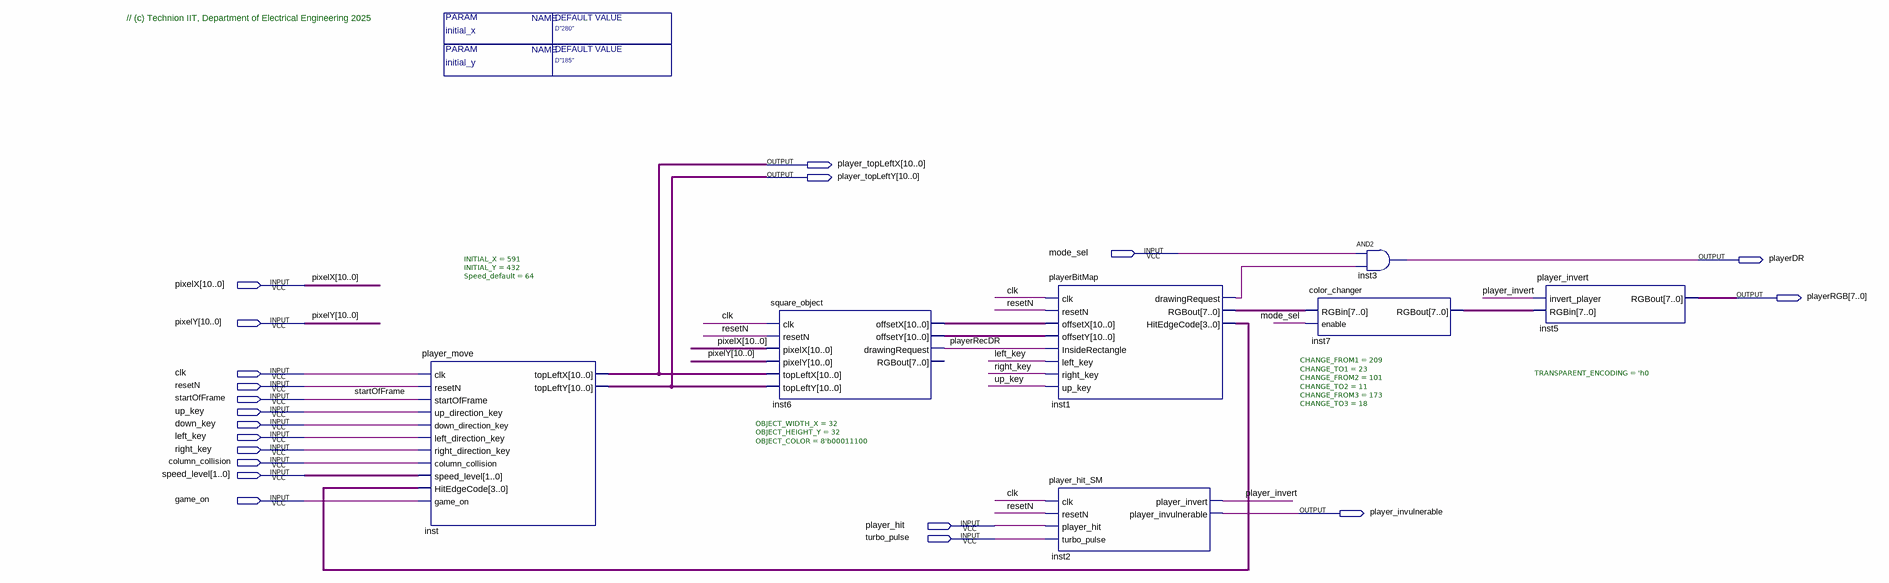
[diagram p0: schematic sheet]
// Quartus schematic Player2_Block_T.bdf as structural Verilog: 7 symbols, 20 pins
module Player2_Block_T #(parameter initial_x = "D\"280\"", parameter initial_y = "D\"185\"") (
  input  mode_sel,
  input  [10:0] pixelX,
  input  [10:0] pixelY,
  input  clk,
  input  resetN,
  input  startOfFrame,
  input  up_key,
  input  down_key,
  input  left_key,
  input  right_key,
  input  column_collision,
  input  [1:0] speed_level,
  input  game_on,
  input  player_hit,
  input  turbo_pulse,
  output [10:0] player_topLeftX,
  output [10:0] player_topLeftY,
  output playerDR,
  output [7:0] playerRGB,
  output player_invulnerable
);

  wire inst1_drawingrequest, player_invert, playerRecDR;
  wire [3:0] inst1_hitedgecode;
  wire [7:0] inst1_rgbout, inst7_rgbout;
  wire [10:0] inst6_offsetx, inst6_offsety;

  player_move #(.INITIAL_X(591), .INITIAL_Y(432), .Speed_default(64)) inst (
    .clk(clk), .resetN(resetN), .startOfFrame(startOfFrame), .up_direction_key(up_key),
    .down_direction_key(down_key), .left_direction_key(left_key), .right_direction_key(right_key),
    .column_collision(column_collision), .speed_level(speed_level), .HitEdgeCode(inst1_hitedgecode),
    .game_on(game_on), .topLeftX(player_topLeftX), .topLeftY(player_topLeftY));
  square_object #(.OBJECT_WIDTH_X(32), .OBJECT_HEIGHT_Y(32), .OBJECT_COLOR(8'b00011100)) inst6 (
    .clk(clk), .resetN(resetN), .pixelX(pixelX), .pixelY(pixelY), .topLeftX(player_topLeftX),
    .topLeftY(player_topLeftY), .offsetX(inst6_offsetx), .offsetY(inst6_offsety), .drawingRequest(playerRecDR));  // open: RGBout
  playerBitMap inst1 (
    .clk(clk), .resetN(resetN), .offsetX(inst6_offsetx), .offsetY(inst6_offsety),
    .InsideRectangle(playerRecDR), .left_key(left_key), .right_key(right_key), .up_key(up_key),
    .drawingRequest(inst1_drawingrequest), .RGBout(inst1_rgbout), .HitEdgeCode(inst1_hitedgecode));
  player_hit_SM inst2 (
    .clk(clk), .resetN(resetN), .player_hit(player_hit), .turbo_pulse(turbo_pulse),
    .player_invert(player_invert), .player_invulnerable(player_invulnerable));
  color_changer #(.CHANGE_FROM1(209), .CHANGE_TO1(23), .CHANGE_FROM2(101), .CHANGE_TO2(11), .CHANGE_FROM3(173), .CHANGE_TO3(18)) inst7 (
    .RGBin(inst1_rgbout), .enable(mode_sel), .RGBout(inst7_rgbout));
  and inst3 (playerDR, mode_sel, inst1_drawingrequest);
  player_invert #(.TRANSPARENT_ENCODING('h0)) inst5 (
    .invert_player(player_invert), .RGBin(inst7_rgbout), .RGBout(playerRGB));

  // Notes on the sheet:
  //   // (c) Technion IIT, Department of Electrical Engineering 2025
endmodule
